# EAGLE design PiMCU_Shield (EAGLE 6.3)
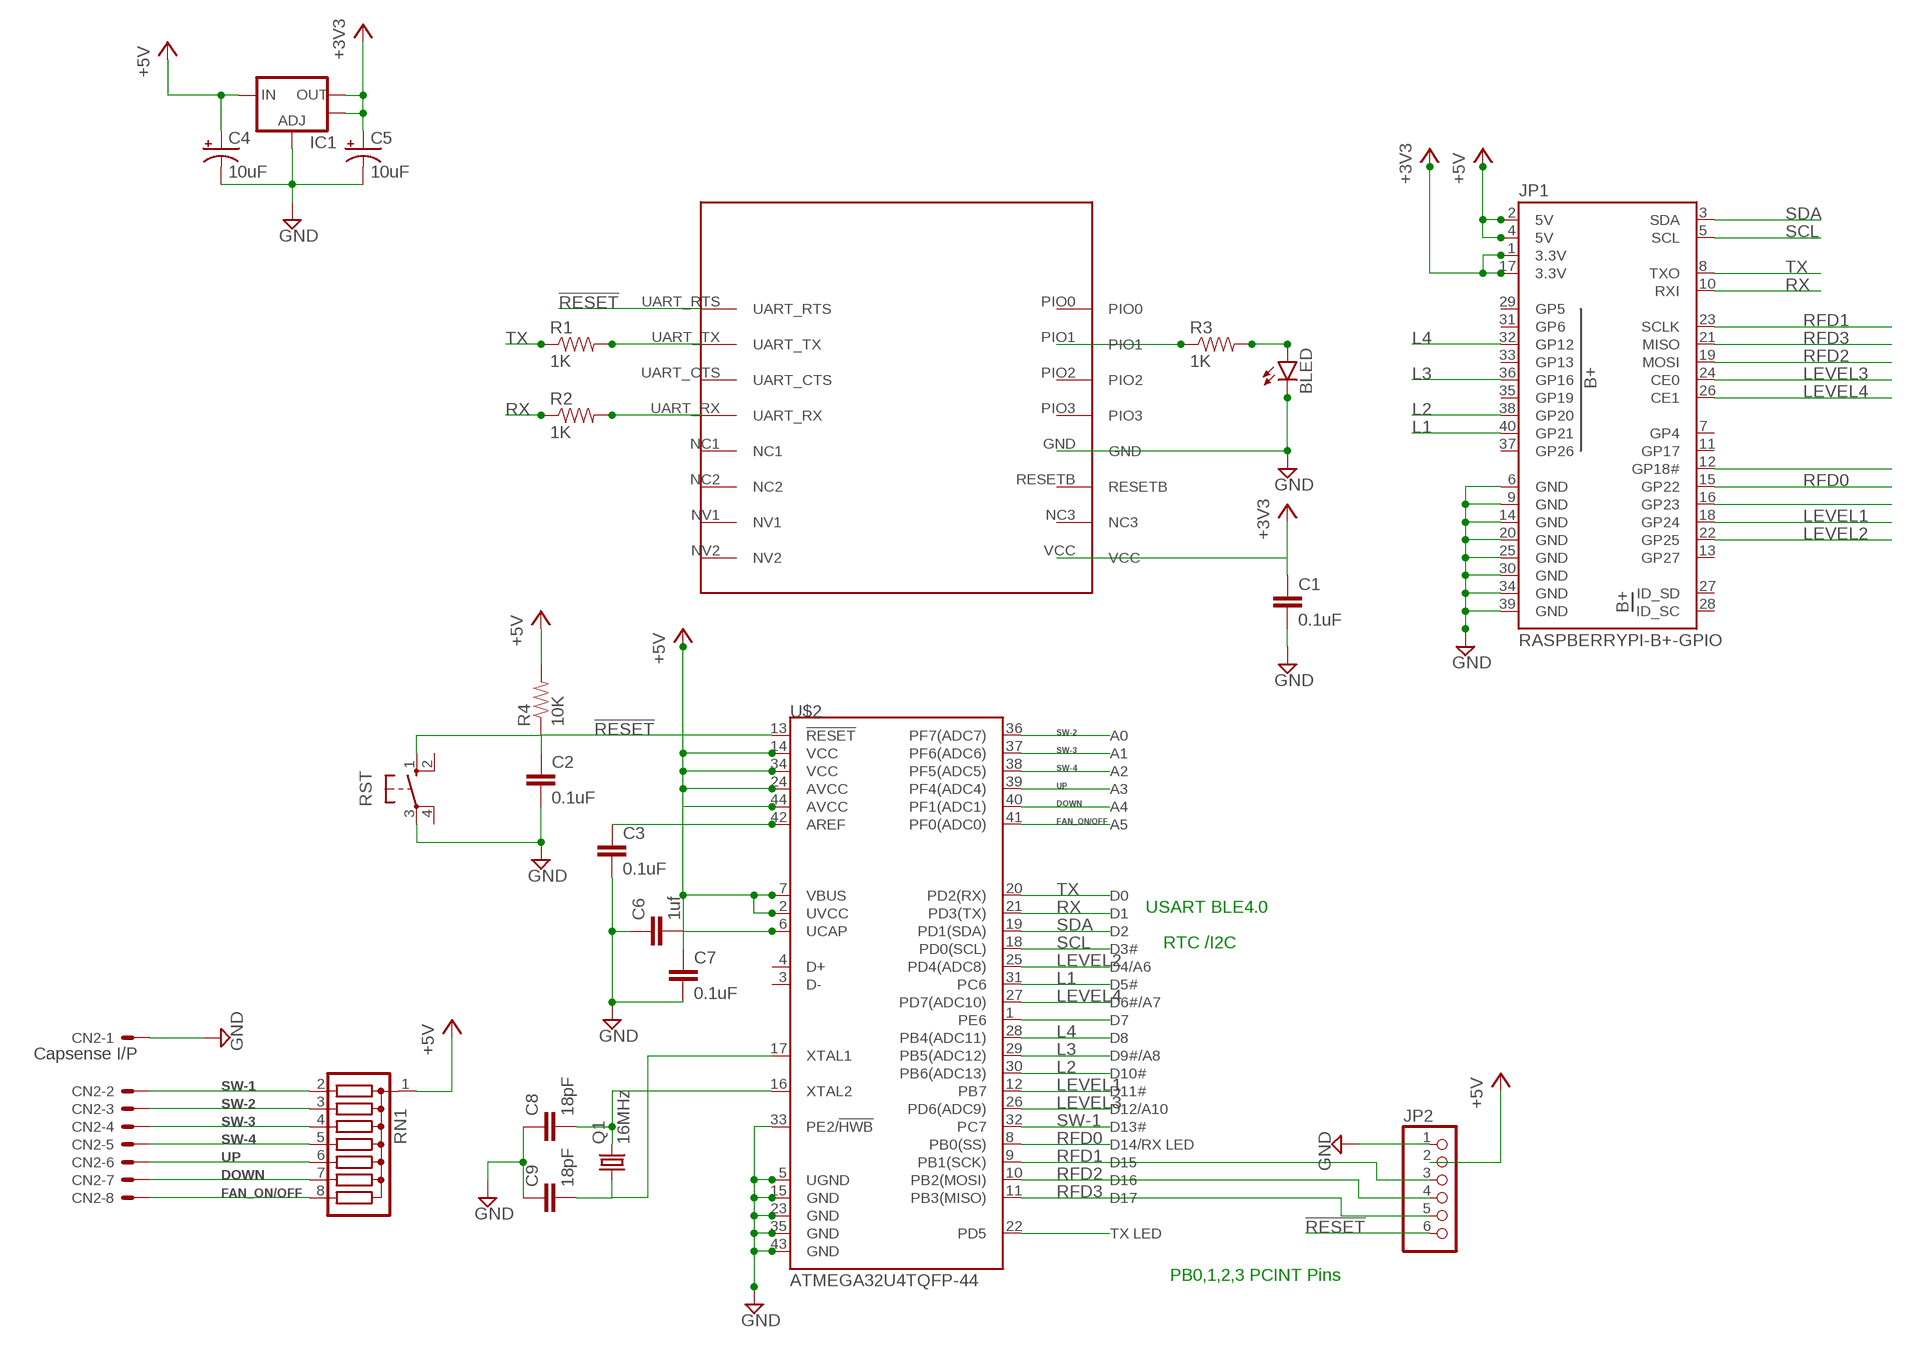
[diagram p0: schematic, sheet 1]

## Parts
BLED  LED1206  [LED-1206]
C1  0.1uF  1.0UF50V10%(1206)  [1206]
C2  0.1uF  1.0UF50V10%(1206)  [1206]
C3  0.1uF  1.0UF50V10%(1206)  [1206]
C4  10uF  10UF-16V-10%(TANT)  [EIA3216]
C5  10uF  10UF-16V-10%(TANT)  [EIA3216]
C6  1uf  1.0UF50V10%(1206)  [1206]
C7  0.1uF  1.0UF50V10%(1206)  [1206]
C8  18pF  CAP1206  [1206]
C9  18pF  CAP1206  [1206]
CN2  Capsense I/P  22-23-2081  [22-23-2081]
IC1  V_REG_LM1117SOT223  [SOT223]
JP1  RASPBERRYPI-B+-GPIO  [2X20-SHROUDED]
JP2  PINHD-1X6  [1X06]
Q1  16MHz  CRYSTALHC49UP  [HC49UP]
R1  1K  RESISTOR1206  [1206]
R2  1K  RESISTOR1206  [1206]
R3  1K  RESISTOR1206  [1206]
R4  10K  RESISTOR1206  [1206]
RN1  G07R  [SIL8]
RST  10-XX  [B3F-10XX]
U$1  HM-11  [HM-11]
U$2  ATMEGA32U4TQFP-44  [TQFP44]

## Nets
!RESET: C2.1 JP2.6 R4.1 RST.1(S) U$1.UART_RTS U$2.13(!RESET)
+3V3: C1.1 C5.A(+) IC1.2(OUT) IC1.4(OUT) JP1.1(3.3V) JP1.17(3.3V) U$1.VCC
+5V: C4.A(+) C7.1 IC1.3(IN) JP1.2(5V) JP1.4(5V) JP2.2 R4.2 RN1.1 U$2.2(UVCC) U$2.7(VBUS) U$2.14(VCC) U$2.24(AVCC) U$2.34(VCC) U$2.44(AVCC)
DOWN: CN2.7 RN1.7 U$2.40(PF1(ADC1))
FAN_ON/OFF: CN2.8 RN1.8 U$2.41(PF0(ADC0))
GND: BLED.C C1.2 C2.2 C3.2 C4.C(-) C5.C(-) C6.1 C7.2 C8.1 C9.1 CN2.1 IC1.1(ADJ) JP1.6(GND) JP1.9(GND) JP1.14(GND) JP1.20(GND) JP1.25(GND) JP1.30(GND) JP1.34(GND) JP1.39(GND) JP2.1 RST.3(P) U$1.GND U$2.5(UGND) U$2.15(GND) U$2.23(GND) U$2.33(PE2/!HWB) U$2.35(GND) U$2.43(GND)
L1: JP1.40(GP21) U$2.31(PC6)
L2: JP1.38(GP20) U$2.30(PB6(ADC13))
L3: JP1.36(GP16) U$2.29(PB5(ADC12))
L4: JP1.32(GP12) U$2.28(PB4(ADC11))
LEVEL1: JP1.18(GP24) U$2.12(PB7)
LEVEL2: JP1.22(GP25) U$2.25(PD4(ADC8))
LEVEL3: JP1.24(CE0) U$2.26(PD6(ADC9))
LEVEL4: JP1.26(CE1) U$2.27(PD7(ADC10))
N$1: R1.2 U$1.UART_TX
N$2: R2.2 U$1.UART_RX
N$3: R3.1 U$1.PIO1
N$4: BLED.A R3.2
N$5: C3.1 U$2.42(AREF)
N$6: JP1.16(GP23)
N$7: C6.2 U$2.6(UCAP)
N$8: JP1.12(GP18#)
N$18: U$2.1(PE6)
N$22: C8.2 Q1.2 U$2.16(XTAL2)
N$23: C9.2 Q1.1 U$2.17(XTAL1)
N$29: U$2.22(PD5)
RFD0: JP1.15(GP22) U$2.8(PB0(SS))
RFD1: JP1.23(SCLK) JP2.3 U$2.9(PB1(SCK))
RFD2: JP1.19(MOSI) JP2.4 U$2.10(PB2(MOSI))
RFD3: JP1.21(MISO) JP2.5 U$2.11(PB3(MISO))
RX: JP1.10(RXI) R2.1 U$2.21(PD3(TX))
SCL: JP1.5(SCL) U$2.18(PD0(SCL))
SDA: JP1.3(SDA) U$2.19(PD1(SDA))
SW-1: CN2.2 RN1.2 U$2.32(PC7)
SW-2: CN2.3 RN1.3 U$2.36(PF7(ADC7))
SW-3: CN2.4 RN1.4 U$2.37(PF6(ADC6))
SW-4: CN2.5 RN1.5 U$2.38(PF5(ADC5))
TX: JP1.8(TXO) R1.1 U$2.20(PD2(RX))
UP: CN2.6 RN1.6 U$2.39(PF4(ADC4))
Unconnected: JP1.7(GP4) JP1.11(GP17) JP1.13(GP27) JP1.27(ID_SD) JP1.28(ID_SC) JP1.29(GP5) JP1.31(GP6) JP1.33(GP13) JP1.35(GP19) JP1.37(GP26) RST.2(S1) RST.4(P1) U$1.NC1 U$1.NC2 U$1.NC3 U$1.NV1 U$1.NV2 U$1.PIO0 U$1.PIO2 U$1.PIO3 U$1.RESETB U$1.UART_CTS U$2.3(D-) U$2.4(D+)

## Notes on the sheet
- USART BLE4.0
- RTC /I2C
- PB0,1,2,3 PCINT Pins

## Library data of the parts
BLED = SparkFun-LED:LED: LEDs Standard schematic elements and footprints for 5mm, 3mm, 1206, and 0603 sized LEDs. 5mm - Spark Fun Electronics SKU : COM-00529 (and others)
C1-C3 C6 C7 = SparkFun-Capacitors:1.0UF50V10%(1206): CAP-09822; PROD_ID: CAP-09822; VALUE: 1.0uF
C4 C5 = SparkFun-Capacitors:10UF-16V-10%(TANT): CAP-00811 1206/EIA-3216 Tantalum capacitor; PROD_ID: CAP-00811
C8 C9 = SparkFun-Passives:CAP: Capacitor Standard 0603 ceramic capacitor, and 0.1" leaded capacitor.
CN2 = con-molex:22-23-2081: .100" (2.54mm) Center Header - 8 Pin; MF: MOLEX; MPN: 22-23-2081; OC_FARNELL: 1756826; OC_NEWARK: 01C7592
IC1 = SparkFun-PowerIC:V_REG_LM1117: Voltage Regulator LM1117 Standard adjustable voltage regulator but in SMD form. Spark Fun Electronics SKU : COM-00595; PROD_ID: VREG-08170
JP1 = SparkFun-Boards:RASPBERRYPI-B+-GPIO: Raspberry Pi B+ GPIO Header 2x20 pin connector
JP2 = pinhead:PINHD-1X6: PIN HEADER
Q1 = crystal:CRYSTAL: CRYSTAL; OC_FARNELL: unknown; OC_NEWARK: unknown
R1-R4 = SparkFun-Passives:RESISTOR: Resistor Basic schematic elements and footprints for 0603, 1206, and PTH resistors.
RN1 = resistor-sil:G07R: SIL RESISTOR; OC_FARNELL: unknown; OC_NEWARK: unknown
RST = switch-omron:10-XX: OMRON SWITCH; MPN: B3F-1000; OC_FARNELL: 176432; OC_NEWARK: 36M3542
U$1 = HM-11:HM-11
U$2 = SparkFun-DigitalIC:ATMEGA32U4: Atmel 44-pin 8-bit Microcontroller with 32KBytes of ISP Flash and USB Controller

## Board
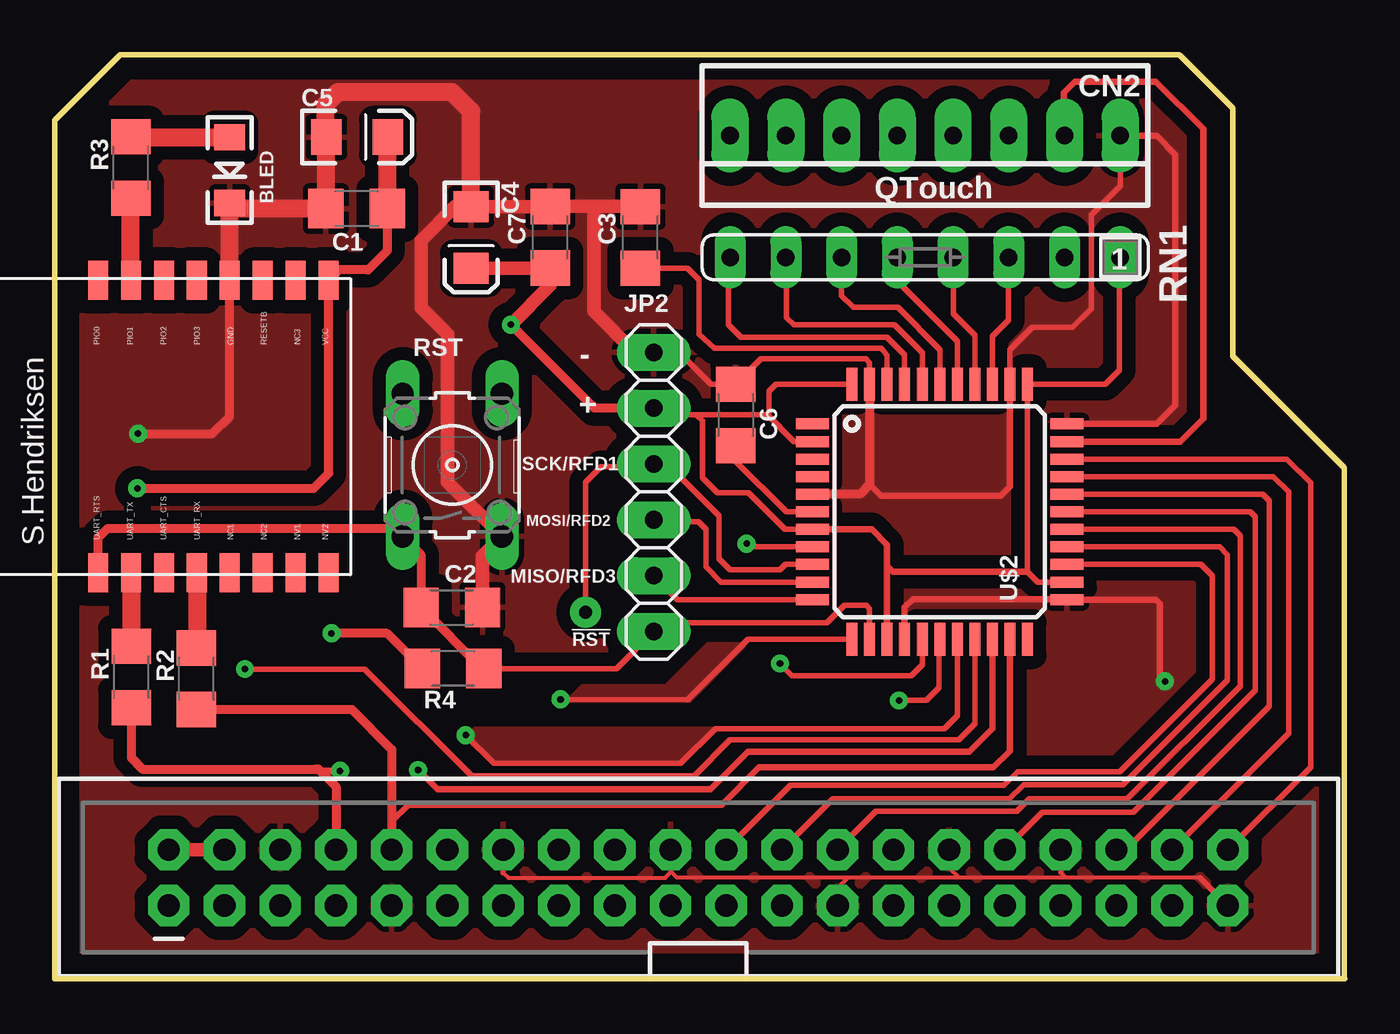
[diagram p1: board, top side]
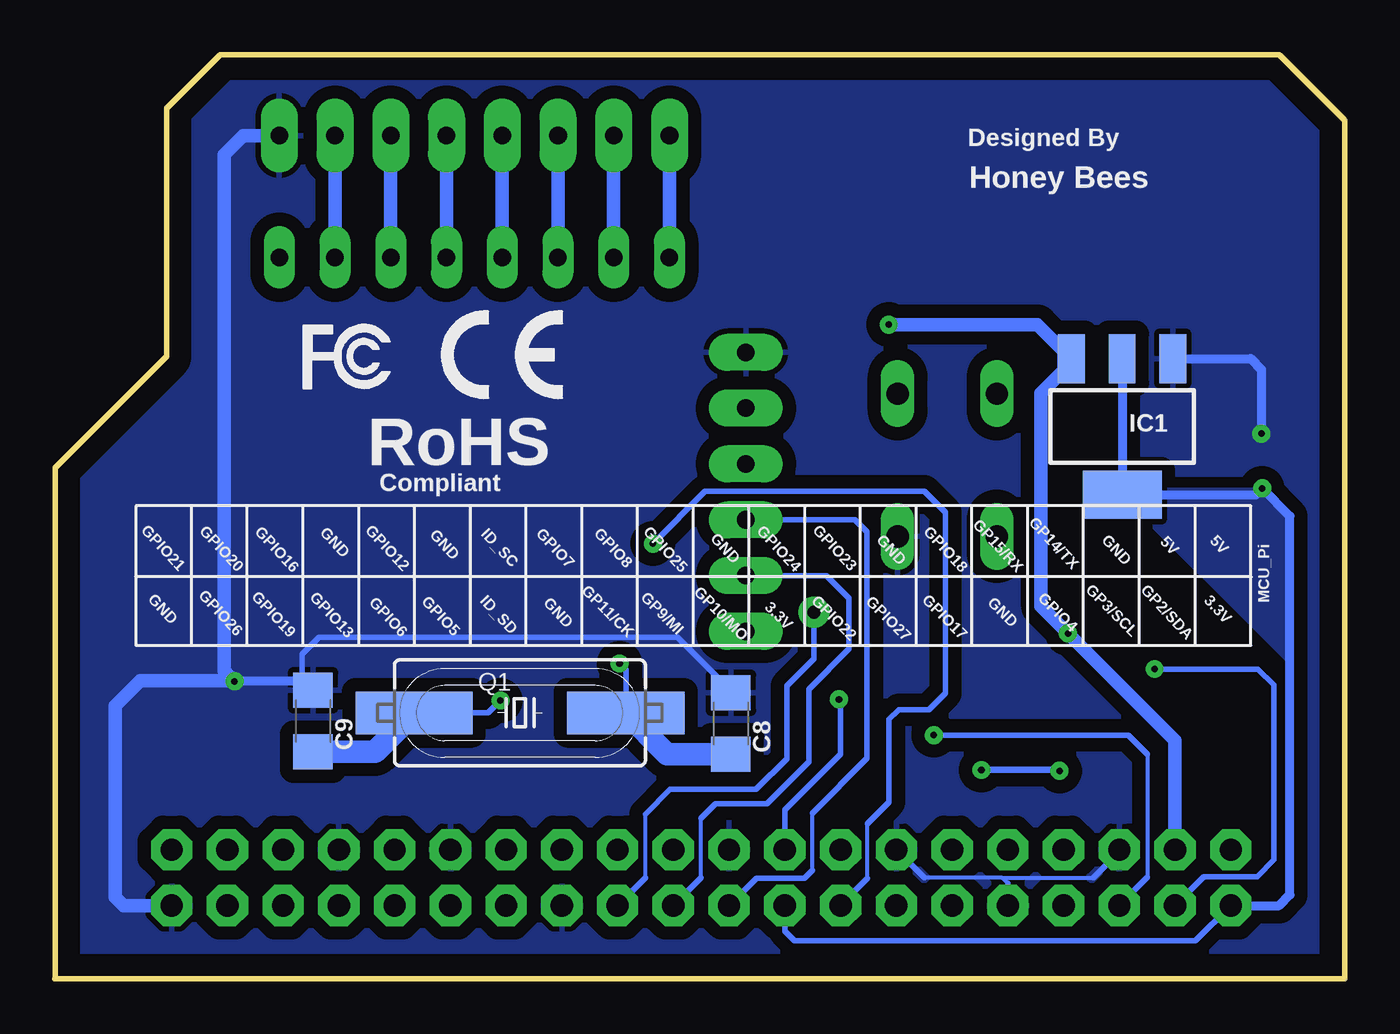
[diagram p2: board, bottom side, seen from below]

Size 58.77 x 42.09 mm. Coordinates in mm from the lower left corner, seen from the top.
Outline: 0.02,39.14 2.95,42.07
Outline: 58.77,0 0,0 0,39.12
Outline: 58.75,0.05 58.75,23.28 53.67,28.36 53.67,39.66 51.26,42.07
Outline: 51.23,42.09 2.97,42.09 2.94,42.06
Copper layers (1*16): Top 0.035mm / dielectric 1.5mm / Bottom 0.035mm
Design rules "default": minimum track width 10mil, minimum drill 24mil, track to track 8mil, track to pad 8mil, pad to pad 8mil, via to via 8mil, smd to smd 8mil, copper to edge 40mil, drill to drill 8mil, minimum pad ring 10mil, minimum via ring 8mil, stop-mask expansion 4mil, vias tented up to drill 0mil, thermal gap 10mil

### Footprints (pad centres in the part's own frame; a part is rotated, then mirrored left to right if it is on the bottom)
LED-1206 = smd 1.2 x 1.4: A -1.5,0; C 1.5,0
1206 = smd 1.6 x 1.8: 1 -1.4,0; 2 1.4,0
EIA3216 = smd 1.4 x 1.6: A 1.4,0; C -1.4,0
22-23-2081 = drill 0.8 pad 1.676 long: 1 -8.89,0; 2 -6.35,0; 3 -3.81,0; 4 -1.27,0; 5 1.27,0; 6 3.81,0; 7 6.35,0; 8 8.89,0
SOT223 = smd 1.219 x 2.235: 1 -2.311,-3.099; 2 0,-3.099; 3 2.311,-3.099 | smd 3.6 x 2.2: 4 0,3.099
2X20-SHROUDED = drill 1.016 pad 1.88 octagon: 1 -1.27,24.13; 2 1.27,24.13; 3 -1.27,21.59; 4 1.27,21.59; 5 -1.27,19.05; 6 1.27,19.05; 7 -1.27,16.51; 8 1.27,16.51; 9 -1.27,13.97; 10 1.27,13.97; 11 -1.27,11.43; 12 1.27,11.43; 13 -1.27,8.89; 14 1.27,8.89; 15 -1.27,6.35; 16 1.27,6.35; 17 -1.27,3.81; 18 1.27,3.81; 19 -1.27,1.27; 20 1.27,1.27; 21 -1.27,-1.27; 22 1.27,-1.27; 23 -1.27,-3.81; 24 1.27,-3.81; 25 -1.27,-6.35; 26 1.27,-6.35; 27 -1.27,-8.89; 28 1.27,-8.89; 29 -1.27,-11.43; 30 1.27,-11.43; 31 -1.27,-13.97; 32 1.27,-13.97; 33 -1.27,-16.51; 34 1.27,-16.51; 35 -1.27,-19.05; 36 1.27,-19.05; 37 -1.27,-21.59; 38 1.27,-21.59; 39 -1.27,-24.13; 40 1.27,-24.13
1X06 = drill 0.8 pad 1.676 long: 1 -6.35,0; 2 -3.81,0; 3 -1.27,0; 4 1.27,0; 5 3.81,0; 6 6.35,0
HC49UP = smd 5.334 x 1.93: 1 -4.826,0; 2 4.826,0
SIL8 = drill 0.8 pad 1.422 long: 1 -8.89,0; 2 -6.35,0; 3 -3.81,0; 4 -1.27,0; 5 1.27,0; 6 3.81,0; 7 6.35,0; 8 8.89,0
B3F-10XX = drill 1.016 long: 1 -3.251,2.261; 2 3.251,2.261; 3 -3.251,-2.261; 4 3.251,-2.261
HM-11 = smd 1.778 x 0.914: GND 7.508,-0.6; NC1 -5.808,-0.6; NC2 -5.808,-2.1; NC3 7.508,-3.6; NV1 -5.808,-3.6; NV2 -5.808,-5.1; PIO0 7.508,5.4; PIO1 7.508,3.9; PIO2 7.508,2.4; PIO3 7.508,0.9; RESETB 7.508,-2.1; UART_CTS -5.808,2.4; UART_RTS -5.808,5.4; UART_RX -5.808,0.9; UART_TX -5.808,3.9; VCC 7.508,-5.1
TQFP44 = smd 1.5 x 0.5: 1 -5.8,4; 2 -5.8,3.2; 3 -5.8,2.4; 4 -5.8,1.6; 5 -5.8,0.8; 6 -5.8,0; 7 -5.8,-0.8; 8 -5.8,-1.6; 9 -5.8,-2.4; 10 -5.8,-3.2; 11 -5.8,-4; 23 5.8,-4; 24 5.8,-3.2; 25 5.8,-2.4; 26 5.8,-1.6; 27 5.8,-0.8; 28 5.8,0; 29 5.8,0.8; 30 5.8,1.6; 31 5.8,2.4; 32 5.8,3.2; 33 5.8,4 | smd 0.5 x 1.5: 12 -4,-5.8; 13 -3.2,-5.8; 14 -2.4,-5.8; 15 -1.6,-5.8; 16 -0.8,-5.8; 17 0,-5.8; 18 0.8,-5.8; 19 1.6,-5.8; 20 2.4,-5.8; 21 3.2,-5.8; 22 4,-5.8; 34 4,5.8; 35 3.2,5.8; 36 2.4,5.8; 37 1.6,5.8; 38 0.8,5.8; 39 0,5.8; 40 -0.8,5.8; 41 -1.6,5.8; 42 -2.4,5.8; 43 -3.2,5.8; 44 -4,5.8

### Placement (x,y rotation side)
BLED  7.96,36.84 270 top
C1  13.75,35.08 180 top
C2  18.08,16.93 0 top
C3  26.68,33.77 90 top
C4  18.97,33.77 270 top
C5  13.77,38.35 0 top
C6  31.01,25.68 270 top
C7  22.57,33.78 90 top
C8  27.97,11.64 270 bottom
C9  47,11.75 270 bottom
CN2  39.65,38.41 180 top
IC1  10.14,25.15 180 bottom
JP1  29.32,4.61 90 top
JP2  27.28,22.18 270 top
Q1  37.58,12.12 0 bottom
R1  3.48,13.75 90 top
R2  6.45,13.67 90 top
R3  3.46,36.95 90 top
R4  18.14,14.14 180 top
RN1  39.65,32.87 180 top
RST  18.11,23.41 90 top
U$1  7.37,24.31 90 top
U$2  40.32,21.28 0 top
U$4  [CE-4MM]  41.21,30.46 180 top
U$5  [FCC_6.1X15MM]  33.17,25.81 0 top

### Tracks (layer width: path | path; a pad name or v marks a point on that pad's centre or on a via)
!RESET
  Top 0.254: U$2.13 37.12,16.87 36.97,17.01 35.97,17.01 35.17,16.21 27.66,16.21 JP2.6 25.58,14.13 R4.1
  Top 0.406: U$1.UART_RTS 1.97,20.08 2.41,20.53 15.47,20.53 RST.1 16.68,19.32 C2.1 19.47,14.13 R4.1
+3V3  (via drill 0.3 pad 0.81)
  Top 0.406: C1.1 15.15,33.17 14.27,32.29 12.95,32.29 U$1.VCC | v3.76,22.35 11.78,22.35 12.47,23.04 U$1.VCC | 12.29,31.63 U$1.VCC
  Top 0.813: C5.A 15.15,38.33 C1.1
  Bottom 0.254: JP1.1 6.8,1.74 25.07,1.74 25.51,2.17 JP1.17
  Bottom 0.406: IC1.2 IC1.4 4.05,22.05 v3.76,22.35 2.5,21.08 2.5,3.83 2.98,3.34 JP1.1
  pour Bottom: 2.48,14.45 2.48,21.05 3.68,22.25 10.26,22.25 10.38,22.37 10.38,22.33 2.48,14.44
+5V  (via drill 0.3 pad 0.81)
  Top 0.254: RN1.1 48.51,32.83 48.51,27.72 47.87,27.08 U$2.34 44.32,18.54 44.79,18.07 U$2.24 | 27.29,26 JP2.2 27.58,25.7 29.22,25.7 | U$2.2 33.69,24.48 32.47,25.7 32.42,25.7 | 32.42,25.7 29.22,25.7 | U$2.44 32.85,27.08 32.54,26.77 32.54,25.82 32.42,25.7 | 29.22,25.7 29.5,25.41 29.5,22.84 30.2,22.14 31.6,22.14 33.26,20.48 U$2.7
  Top 0.305: U$2.7 37.22,20.48 37.92,19.78 37.92,18.81 | 37.92,18.81 U$2.14 | 44.32,18.54 38.19,18.54 37.92,18.81
  Top 0.406: JP2.2 24.58,25.99 v20.78,29.8 | R4.2 15.14,15.74 v12.61,15.74
  Top 0.61: C4.A 22.56,32.37 C7.1 22.57,31.59 v20.78,29.8 | JP1.2 JP1.4
  Bottom 0.61: IC1.3 12.8,28.6 | 12.8,28.6 14,29.8 v20.78,29.8 | JP1.4 7.73,10.86 v12.61,15.74 13.83,16.97 13.83,26.68 12.8,27.72 12.8,28.6
DOWN
  Top 0.254: U$2.40 39.52,28.52 38.25,29.79 33.67,29.79 33.34,30.11 33.34,32.83 RN1.7
  Bottom 0.61: CN2.7 RN1.7
FAN_ON/OFF
  Top 0.254: U$2.41 38.72,28.43 37.92,29.23 31.25,29.23 30.69,29.8 30.69,32.79 RN1.8
  Bottom 0.61: CN2.8 RN1.8
GND  (via drill 0.3 pad 0.81)
  Top 0.178: 20.43,4.84 20.67,4.6 27.81,4.6 28.08,4.88 28.34,4.62 36.13,4.62 | 52.17,4.62 46.06,4.62 | 46.06,4.62 41.2,4.62 | 41.2,4.62 36.13,4.62 | 35.67,4.16 36.13,4.62 | 40.75,5.08 41.2,4.62 | 45.83,4.85 46.06,4.62
  Top 0.254: U$2.35 43.52,28.65 44.54,29.68 46.37,29.68 47.23,30.53 47.23,34.81 48.54,36.12 CN2.1 | U$2.43 37.12,28.07 36.94,28.24 32.17,28.24 C6.1 29.9,27.08 28.46,28.53 JP2.1 | JP1.14 20.43,4.84 | 28.08,4.88 28.08,5.85 JP1.20 | JP1.39 52.17,4.62 | JP1.25 35.67,4.16 | JP1.30 40.75,5.08 | JP1.34 45.83,4.85
  Top 0.305: U$2.33 50.21,25.28 51.06,26.13 51.06,37.54 50.2,38.4 CN2.1 | U$2.15 38.72,16.93 39.08,17.3 46.1,17.3 U$2.23 50.16,17.28 50.36,17.08 50.36,13.78 v50.58,13.55 | U$2.35 43.52,22.41 43.11,22 37.64,22 37.12,22.52
  Top 0.406: U$2.43 37.12,22.52 36.67,22.08 U$2.5 | v3.79,24.83 7.18,24.83 7.96,25.62 7.96,31.8 U$1.GND
  Top 0.61: 24.33,35.18 C7.2 22.56,35.17 C4.C 18.22,35.17 16.68,33.63 16.68,30.57 17.89,29.36 17.89,22.63 RST.3 19.48,19.27 C2.2 | 24.33,35.18 26.67,35.18 C3.2 | JP2.1 26.43,28.53 24.55,30.4 24.55,34.96 24.33,35.18
  Top 0.813: U$1.GND 7.96,31.83 BLED.C 8.22,35.08 C1.2 12.35,38.33 C5.C 12.32,38.39 12.32,39.82 12.89,40.39 18.1,40.39 18.97,39.52 C4.C
  Bottom 0.178: 15.6,4.6 11.44,4.6 | 15.35,4.35 15.6,4.6 | 15.6,4.6 19.14,4.6
  Bottom 0.254: 11.44,4.6 10.27,5.77 JP1.6 | JP1.9 15.35,4.35 | C8.1 27.97,13.06 27.93,13.11 30.39,15.57 46.72,15.57 47.5,14.78 47.5,13.55 | 19.14,4.6 JP1.14
  Bottom 0.406: C9.1 47.4,13.55 47.5,13.55 v50.58,13.55 | IC1.1 4.28,28.25 3.79,27.76 v3.79,24.83
  Bottom 0.61: JP1.39 55.63,3.34 56.01,3.72 56.01,12.44 54.88,13.57 50.6,13.57 v50.58,13.55 51.06,14.04 51.06,37.54 50.19,38.41 CN2.1
  pour Bottom (isolate 0.61): -0.03,39.13 2.93,42.09 51.2,42.09 53.66,39.63 53.66,28.42 58.73,23.36 58.73,0.03 -0.03,0.03 -0.03,39.12
  pour Top (isolate 0.61): 0.01,39.12 2.97,42.08 51.19,42.08 53.66,39.61 53.66,28.45 58.68,23.43 58.68,0.07 -0.01,0.07 -0.01,39.1
L1
  Top 0.254: JP1.40 57.21,9.65 57.21,22.6 56.14,23.68 U$2.31
L2
  Top 0.254: JP1.38 56.21,11.19 56.21,22.18 55.52,22.88 U$2.30
L3
  Top 0.254: JP1.36 48.79,5.88 55.33,12.43 55.33,21.78 55.03,22.08 U$2.29
L4
  Top 0.254: JP1.32 44.98,7.58 49.13,7.58 54.7,13.15 54.7,21.04 54.46,21.28 U$2.28
LEVEL1  (via drill 0.3 pad 0.81)
  Top 0.254: v23.04,12.74 28.82,12.71 31.59,15.48 U$2.12
  Bottom 0.254: JP1.18 25.51,7.71 22.97,10.24 22.97,12.48 v23.04,12.74
  pour Top: 23.48,12.7 28.89,12.7 31.41,15.22 29.78,15.22 27.86,13.3 24.07,13.3 23.46,12.69
LEVEL2
  Top 0.254: JP1.22 33.51,8.81 43.25,8.81 43.88,9.45 48.53,9.45 52.73,13.65 52.73,18.37 52.22,18.88 U$2.25
LEVEL3
  Top 0.254: JP1.24 35.44,8.2 43.5,8.2 44.15,8.85 48.67,8.85 53.43,13.61 53.43,19.32 53.07,19.68 U$2.26
LEVEL4
  Top 0.254: JP1.26 37.41,7.63 43.82,7.63 44.4,8.21 48.87,8.21 54.01,13.34 54.01,20.17 53.71,20.48 U$2.27
N$1
  Top 0.813: U$1.UART_TX R1.2
N$2
  Top 0.813: U$1.UART_RX 6.47,15.1 R2.2
N$3
  Top 0.813: U$1.PIO1 3.46,31.83 R3.1
N$4
  Top 0.813: R3.2 3.48,38.34 BLED.A
N$5
  Top 0.254: U$2.42 37.92,28.4 37.67,28.73 30.06,28.73 29.35,29.36 29.35,31.86 28.83,32.38 C3.1
N$7
  Top 0.254: 31.04,24.26 C6.2 31.01,23.59 33.32,21.28 U$2.6
N$22  (via drill 0.3 pad 0.81)
  Top 0.254: v33.04,14.37 33.59,13.82 39.03,13.82 39.52,14.31 U$2.16
  Bottom 0.254: Q1.2 32.75,14.08 v33.04,14.37
  Bottom 1.016: Q1.2 30.87,10.24 C8.2
N$23  (via drill 0.3 pad 0.81)
  Top 0.254: v38.46,12.68 39.71,12.68 40.29,13.27 40.29,15.45 U$2.17
  Bottom 0.254: Q1.1 39.02,12.12 v38.46,12.68
  Bottom 1.016: Q1.1 44.17,10.35 C9.2
RFD0  (via drill 0.3 pad 0.81)
  Top 0.254: U$2.8 31.66,19.68 v31.51,19.83
  Bottom 0.178: 21.73,4.59 21.73,7.07
  Bottom 0.254: v31.51,19.83 29.13,22.21 19.15,22.21 18.19,21.25 18.19,13.02 18.94,12.27 20.31,12.27 20.76,11.82 20.76,8.05 21.73,7.07 | 21.73,4.59 22.97,3.35 JP1.15
RFD1  (via drill 0.6 pad 1.42)
  Top 0.254: U$2.9 33.29,18.88 33.04,18.63 30.75,18.63 30.25,19.13 30.25,21.1 28.42,22.93 27.8,22.93 JP2.3 27.15,23.33 24.88,23.33 24.18,22.62 v24.18,16.7
  Bottom 0.178: 31.86,4.61 31.86,7.5
  Bottom 0.254: JP1.23 31.86,4.61 | 31.86,7.5 30.73,8.64 26.82,8.64 25.41,10.04 25.41,13.35 24.18,14.58 v24.18,16.7
RFD2
  Top 0.254: U$2.10 30.36,18.08 29.66,18.77 29.66,20.49 29.33,20.82 27.38,20.82 JP2.4
  Bottom 0.178: 24.24,4.95 24.24,7.56
  Bottom 0.254: JP1.19 26.8,4.59 24.61,4.59 24.24,4.95 | JP2.4 22.31,20.91 21.76,20.36 21.76,10.04 24.24,7.56
RFD3
  Top 0.254: U$2.11 28.38,17.28 JP2.5
  Bottom 0.178: 29.33,4.6 29.33,7.32
  Bottom 0.254: JP1.21 29.33,4.6 | JP2.5 23.62,18.37 22.57,17.33 22.57,15.04 24.42,13.2 24.42,9.9 26.33,7.99 28.66,7.99 29.33,7.32
RX
  Top 0.305: U$2.21 43.52,10.38 42.77,9.63 32.07,9.63 30.39,7.94 16.12,7.94 15.35,7.18
  Top 0.406: R2.1 13.53,12.28 15.35,10.45 15.35,7.18 JP1.10
SCL  (via drill 0.3 pad 0.81)
  Top 0.254: U$2.18 41.12,11.99 40.53,11.41 30.1,11.41 28.51,9.81 20,9.81 v18.72,11.1
  Bottom 0.178: 8.98,10.24 8.98,4.64
  Bottom 0.254: v18.72,11.1 9.84,11.1 8.98,10.24 | 8.98,4.64 10.27,3.35 JP1.5
  pour Top: 18.91,11.13 19.15,11.36 30,11.36 28.5,9.86 20.04,9.86 18.9,11 18.9,11.12
SDA  (via drill 0.3 pad 0.81)
  Top 0.254: U$2.19 41.92,11.62 41.18,10.88 30.77,10.88 29.13,9.25 18.98,9.25 14.11,14.11 v8.66,14.11
  Bottom 0.254: v8.66,14.11 3.95,14.11 3.22,13.39 3.22,5.42 3.99,4.66 6.41,4.66 JP1.3
SW-1
  Top 0.305: U$2.32 51.29,24.48 52.32,25.51 52.32,38.71 50.17,40.86 46.48,40.86 45.98,40.37 45.98,38.43 CN2.2
  Bottom 0.61: CN2.2 RN1.2
SW-2
  Top 0.254: U$2.36 42.72,29.27 43.46,30.01 43.46,32.86 RN1.3
  Bottom 0.61: CN2.3 RN1.3
SW-3
  Top 0.254: U$2.37 41.92,29.33 40.94,30.3 40.94,32.86 RN1.4
  Bottom 0.61: CN2.4 RN1.4
SW-4
  Top 0.254: U$2.38 41.12,29.04 38.38,31.77 RN1.5
  Bottom 0.61: CN2.5 RN1.5
TX  (via drill 0.3 pad 0.81)
  Top 0.305: U$2.20 42.72,11.39 41.67,10.34 31.58,10.34 29.87,8.63 17.44,8.63 v16.55,9.52 | v12.99,9.47 11.96,9.47 11.87,9.56
  Top 0.406: R1.1 3.48,10.07 3.99,9.56 11.87,9.56 12.01,9.56 12.81,8.75 12.81,5.89 JP1.8
  Bottom 0.305: v16.55,9.52 13.04,9.52 v12.99,9.47
UP
  Top 0.254: U$2.39 40.32,28.67 38.4,30.58 36.39,30.58 35.85,31.12 RN1.6
  Bottom 0.61: CN2.6 RN1.6

### Text on the board
tPlace: QTouch | - | + | SCK/RFD1 | MOSI/RFD2 | MISO/RFD3 | !RST
bPlace: Designed By | Honey Bees | RoHS | Compliant